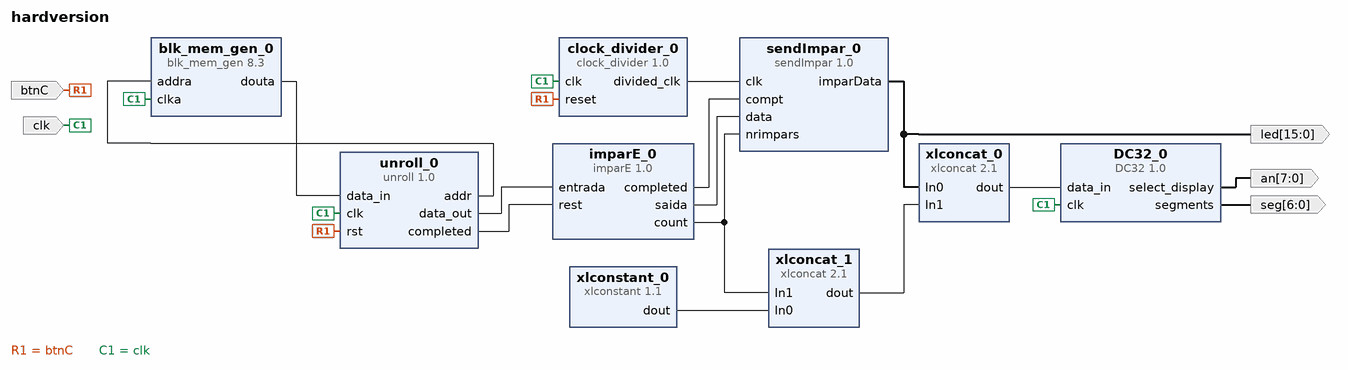
[diagram p0: block diagram of the top level]
# Vivado block design hardversion, Vivado 2015.4
create_bd_design hardversion

create_bd_port -dir I btnC
create_bd_port -dir I clk
create_bd_port -dir O -from 6 -to 0 seg
create_bd_port -dir O -from 7 -to 0 an
create_bd_port -dir O -from 15 -to 0 led

create_bd_cell -type ip -vlnv xilinx.com:ip:blk_mem_gen:8.3 blk_mem_gen_0
set_property -dict [list \
  CONFIG.Memory_Type Single_Port_ROM \
  CONFIG.Enable_32bit_Address false \
  CONFIG.Write_Width_A 16 \
  CONFIG.Write_Depth_A 16 \
  CONFIG.Enable_A Always_Enabled \
  CONFIG.Register_PortA_Output_of_Memory_Primitives false \
  CONFIG.Load_Init_File true \
  CONFIG.Coe_File ../../../../../../../16de16bits.coe \
  CONFIG.Use_RSTA_Pin false \
  CONFIG.Port_A_Write_Rate 0 \
  CONFIG.use_bram_block Stand_Alone \
] [get_bd_cells blk_mem_gen_0]
create_bd_cell -type ip -vlnv xilinx.com:user:clock_divider:1.0 clock_divider_0
create_bd_cell -type ip -vlnv xilinx.com:user:unroll:1.0 unroll_0
set_property -dict {CONFIG.data_width 16} [get_bd_cells unroll_0]
create_bd_cell -type ip -vlnv xilinx.com:user:imparE:1.0 imparE_0
set_property -dict {CONFIG.L 16 CONFIG.M 16} [get_bd_cells imparE_0]
create_bd_cell -type ip -vlnv xilinx.com:ip:xlconcat:2.1 xlconcat_0
set_property -dict {CONFIG.IN0_WIDTH 16 CONFIG.IN1_WIDTH 16} [get_bd_cells xlconcat_0]
create_bd_cell -type ip -vlnv ua.pt:user:DC32:1.0 DC32_0
create_bd_cell -type ip -vlnv xilinx.com:ip:xlconcat:2.1 xlconcat_1
set_property -dict {CONFIG.IN0_WIDTH 12 CONFIG.IN1_WIDTH 4} [get_bd_cells xlconcat_1]
create_bd_cell -type ip -vlnv xilinx.com:ip:xlconstant:1.1 xlconstant_0
set_property -dict {CONFIG.CONST_WIDTH 12 CONFIG.CONST_VAL 0} [get_bd_cells xlconstant_0]
create_bd_cell -type ip -vlnv xilinx.com:user:sendImpar:1.0 sendImpar_0
set_property -dict {CONFIG.L 16 CONFIG.M 16} [get_bd_cells sendImpar_0]

# ---- connections ----

connect_bd_net [get_bd_ports btnC] [get_bd_pins clock_divider_0/reset] [get_bd_pins unroll_0/rst]
connect_bd_net [get_bd_ports clk] \
  [get_bd_pins blk_mem_gen_0/clka] [get_bd_pins clock_divider_0/clk] [get_bd_pins unroll_0/clk] [get_bd_pins DC32_0/clk]
connect_bd_net [get_bd_pins blk_mem_gen_0/douta] [get_bd_pins unroll_0/data_in]
connect_bd_net [get_bd_pins unroll_0/addr] [get_bd_pins blk_mem_gen_0/addra]
connect_bd_net [get_bd_pins unroll_0/data_out] [get_bd_pins imparE_0/entrada]
connect_bd_net [get_bd_pins unroll_0/completed] [get_bd_pins imparE_0/rest]
connect_bd_net [get_bd_pins imparE_0/completed] [get_bd_pins sendImpar_0/compt]
connect_bd_net [get_bd_pins imparE_0/saida] [get_bd_pins sendImpar_0/data]
connect_bd_net [get_bd_pins DC32_0/segments] [get_bd_ports seg]
connect_bd_net [get_bd_pins DC32_0/select_display] [get_bd_ports an]
connect_bd_net [get_bd_pins xlconcat_0/dout] [get_bd_pins DC32_0/data_in]
connect_bd_net [get_bd_pins imparE_0/count] [get_bd_pins xlconcat_1/In1] [get_bd_pins sendImpar_0/nrimpars]
connect_bd_net [get_bd_pins xlconstant_0/dout] [get_bd_pins xlconcat_1/In0]
connect_bd_net [get_bd_pins sendImpar_0/imparData] [get_bd_ports led] [get_bd_pins xlconcat_0/In0]
connect_bd_net [get_bd_pins clock_divider_0/divided_clk] [get_bd_pins sendImpar_0/clk]
connect_bd_net [get_bd_pins xlconcat_1/dout] [get_bd_pins xlconcat_0/In1]

validate_bd_design
save_bd_design
